# EAGLE design with-zener (EAGLE 7.6.0)
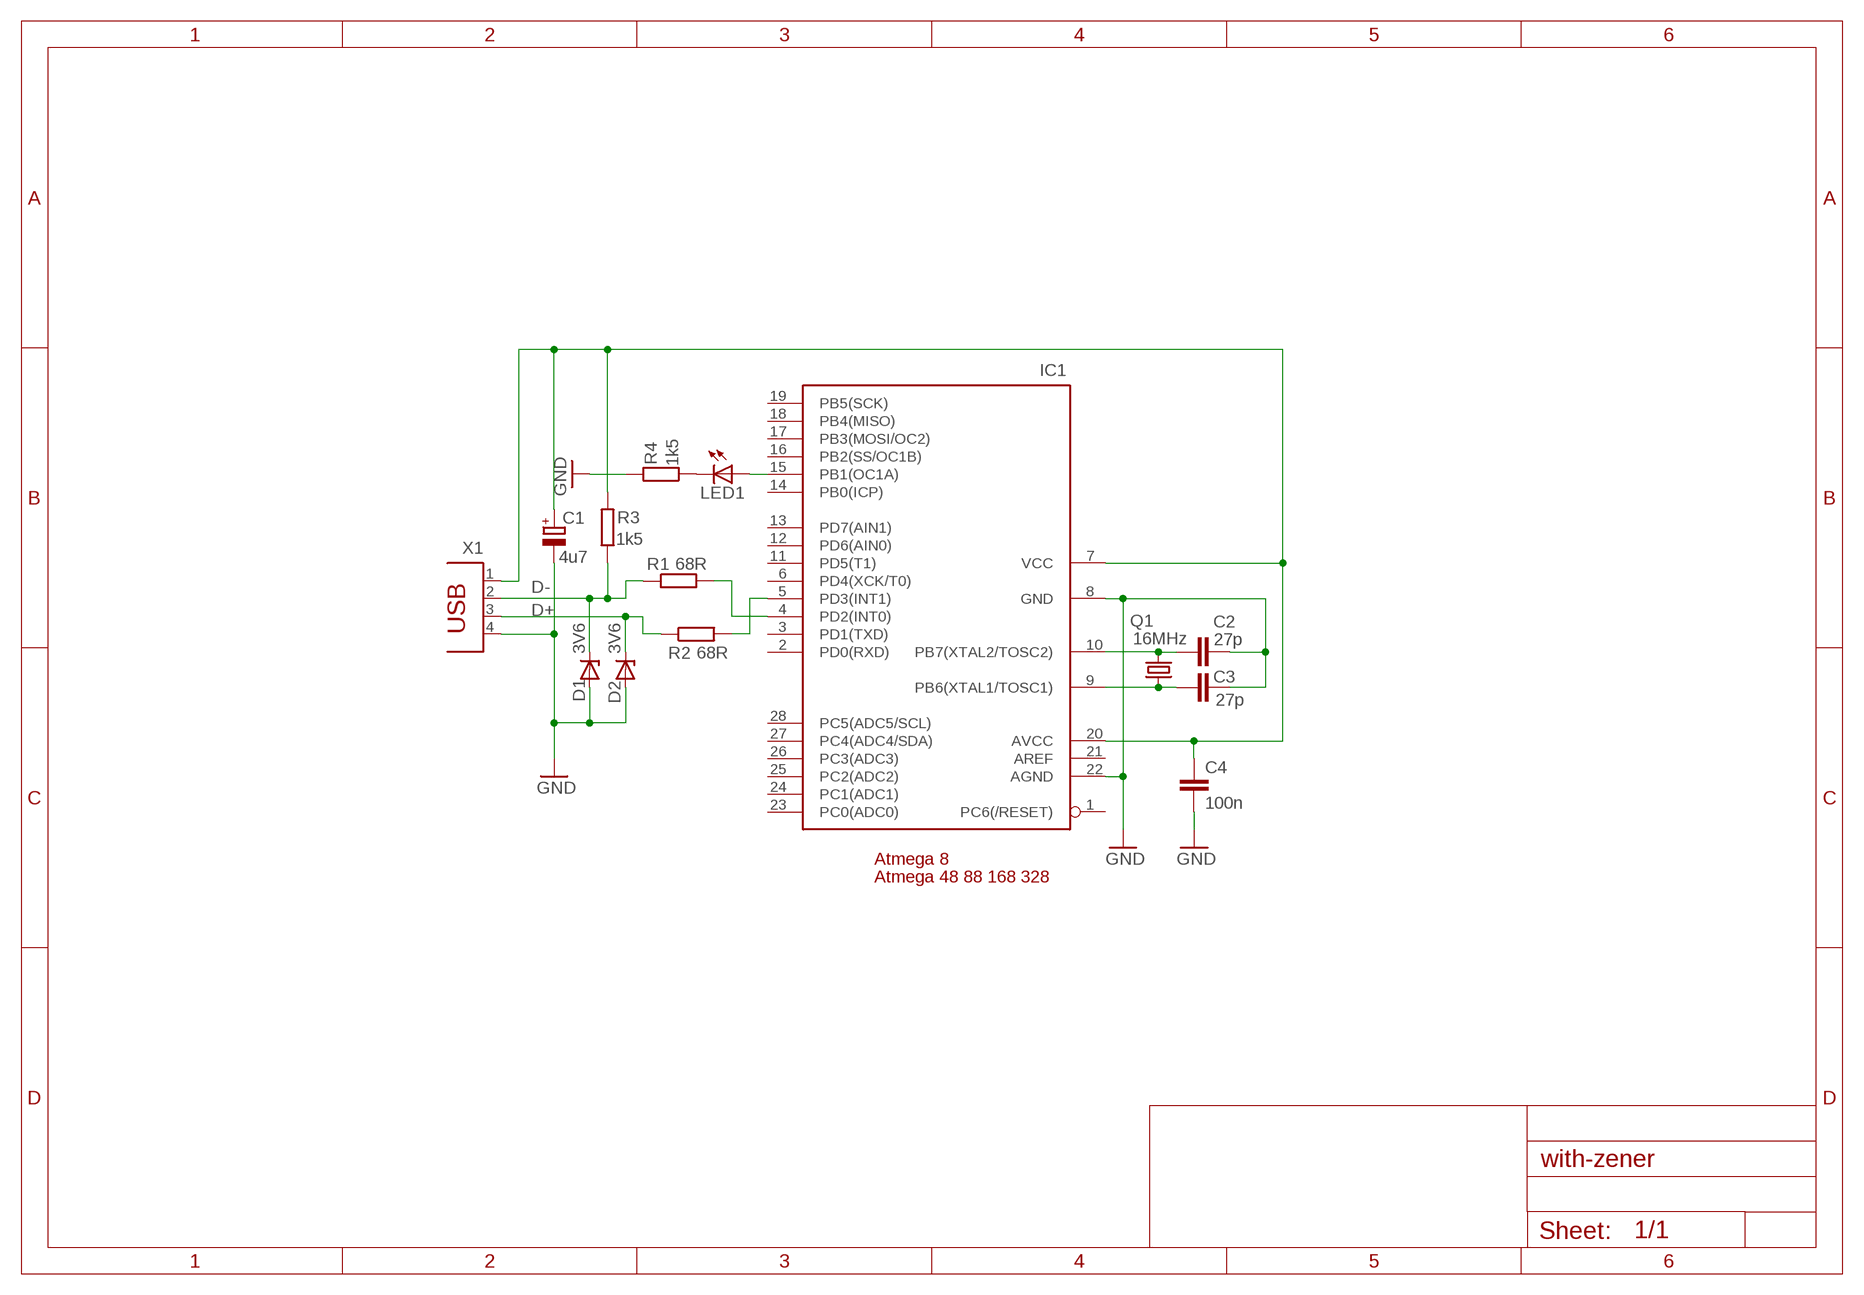
[diagram p0: schematic, sheet 1]

## Parts
C1  4u7  CPOL-EUE2-5  [E2-5]
C2  27p  C-EU025-024X044  [C025-024X044]
C3  27p  C-EU025-024X044  [C025-024X044]
C4  100n  C-EU025-024X044  [C025-024X044]
D1  3V6  ZENER-DIODEDO34-7  [DO34Z7]
D2  3V6  ZENER-DIODEDO34-7  [DO34Z7]
IC1  ATMEGA8-16P  [DIL28-3]
LED1  LED-3MM  [LED-3MM]
Q1  16MHz  CRYTALHC49U-V  [HC49U-V]
R1  68R  R-EU_0207/10  [0207/10]
R2  68R  R-EU_0207/10  [0207/10]
R3  1k5  R-EU_0207/10  [0207/10]
R4  1k5  R-EU_0207/10  [0207/10]
X1  PN61729  [PN61729]

## Nets
D+: D2.C R2.1 X1.3
D-: D1.C R1.1 R3.1 X1.2
GND: C1.- C2.2 C3.2 C4.2 D1.A D2.A IC1.8(GND) IC1.22(AGND) R4.2 X1.4
N$1: IC1.4(PD2(INT0)) R1.2
N$2: IC1.5(PD3(INT1)) R2.2
N$3: IC1.15(PB1(OC1A)) LED1.A
N$4: LED1.K(C) R4.1
N$9: C3.1 IC1.9(PB6(XTAL1/TOSC1)) Q1.1
N$10: C2.1 IC1.10(PB7(XTAL2/TOSC2)) Q1.2
VCC: C1.+ C4.1 IC1.7(VCC) IC1.20(AVCC) R3.2 X1.1
Unconnected: IC1.1(PC6(/RESET)) IC1.2(PD0(RXD)) IC1.3(PD1(TXD)) IC1.6(PD4(XCK/T0)) IC1.11(PD5(T1)) IC1.12(PD6(AIN0)) IC1.13(PD7(AIN1)) IC1.14(PB0(ICP)) IC1.16(PB2(SS/OC1B)) IC1.17(PB3(MOSI/OC2)) IC1.18(PB4(MISO)) IC1.19(PB5(SCK)) IC1.21(AREF) IC1.23(PC0(ADC0)) IC1.24(PC1(ADC1)) IC1.25(PC2(ADC2)) IC1.26(PC3(ADC3)) IC1.27(PC4(ADC4/SDA)) IC1.28(PC5(ADC5/SCL))

## Notes on the sheet
- Atmega 8
- Atmega 48 88 168 328

## Library data of the parts
C1 = rcl:CPOL-EU: POLARIZED CAPACITOR, European symbol
C2-C4 = rcl:C-EU: CAPACITOR, European symbol
D1 D2 = diode:ZENER-DIODE: Z-Diode
IC1 = avr:ATMEGA8*P: MICROCONTROLLER 8 Kbytes FLASH 1 kbytes SRAM 512 bytes EEPROM USART 4-channel 10 bit ADC 2-channel 8 bit ADC
LED1 = dp_devices:LED: Light Emitting Diode
Q1 = crystal:CRYTAL: CRYSTAL
R1-R4 = rcl:R-EU_: RESISTOR, European symbol
X1 = con-berg:PN61729: BERG USB connector

## Board
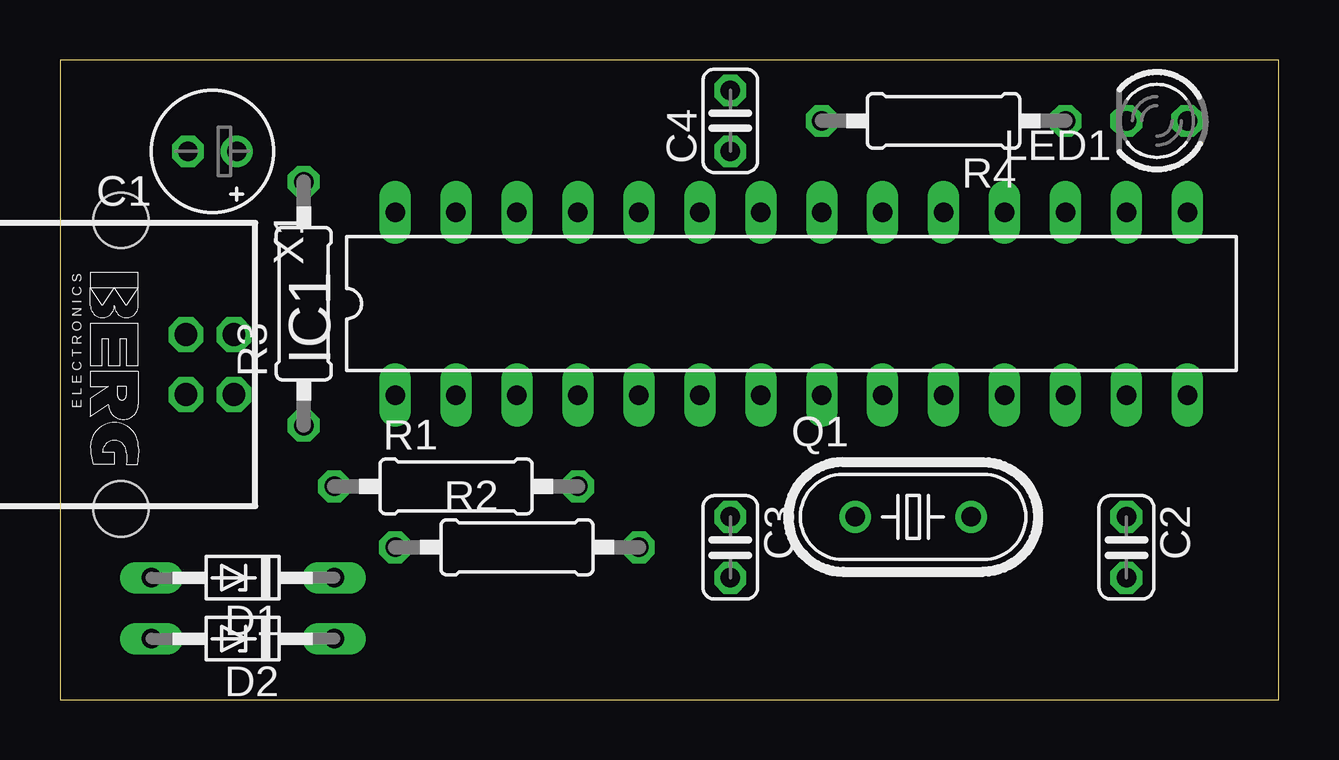
[diagram p1: board, top side]
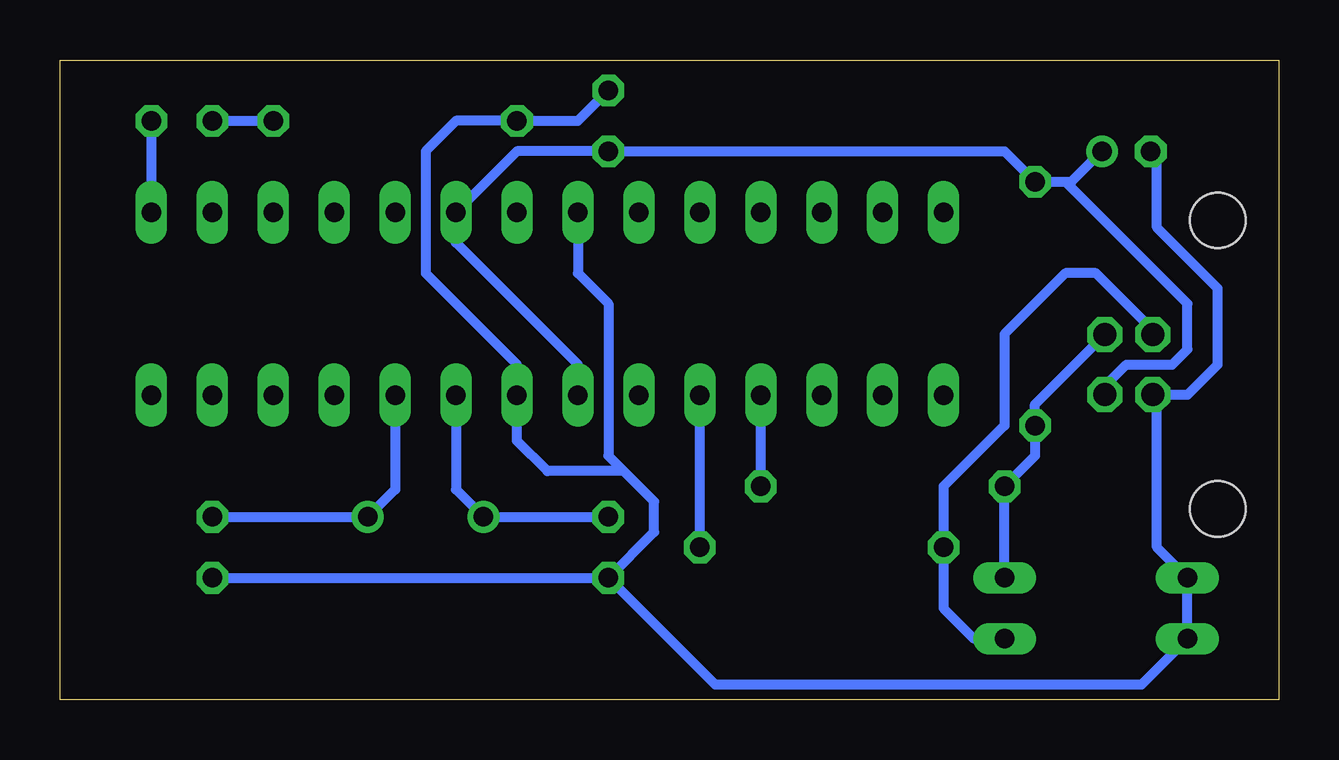
[diagram p2: board, bottom side, seen from below]

Size 50.8 x 26.67 mm. Coordinates in mm from the lower left corner, seen from the top.
Outline: 0,0 50.8,0 50.8,26.67 0,26.67 0,0
Copper layers (1*16): Top 0.035mm / dielectric 1.5mm / Bottom 0.035mm
Design rules "default": minimum track width 10mil, minimum drill 24mil, track to track 8mil, track to pad 8mil, pad to pad 8mil, via to via 8mil, smd to smd 8mil, copper to edge 40mil, drill to drill 8mil, minimum pad ring 10mil, minimum via ring 8mil, stop-mask expansion 4mil, vias tented up to drill 0mil, thermal gap 10mil

### Footprints (pad centres in the part's own frame; a part is rotated, then mirrored left to right if it is on the bottom)
E2-5 = drill 0.813 pad 1.27: + -1.016,0 | drill 0.813 pad 1.27 octagon: - 1.016,0
C025-024X044 = drill 0.813 octagon: 1 -1.27,0; 2 1.27,0
DO34Z7 = drill 0.813 long: A 3.81,0; C -3.81,0
DIL28-3 = drill 0.813 long: 1 -16.51,-3.81; 2 -13.97,-3.81; 3 -11.43,-3.81; 4 -8.89,-3.81; 5 -6.35,-3.81; 6 -3.81,-3.81; 7 -1.27,-3.81; 8 1.27,-3.81; 9 3.81,-3.81; 10 6.35,-3.81; 11 8.89,-3.81; 12 11.43,-3.81; 13 13.97,-3.81; 14 16.51,-3.81; 15 16.51,3.81; 16 13.97,3.81; 17 11.43,3.81; 18 8.89,3.81; 19 6.35,3.81; 20 3.81,3.81; 21 1.27,3.81; 22 -1.27,3.81; 23 -3.81,3.81; 24 -6.35,3.81; 25 -8.89,3.81; 26 -11.43,3.81; 27 -13.97,3.81; 28 -16.51,3.81
LED-3MM = drill 0.813 octagon: A -1.27,0; K 1.27,0
HC49U-V = drill 0.813: 1 -2.413,0; 2 2.413,0
0207/10 = drill 0.813 octagon: 1 -5.08,0; 2 5.08,0
PN61729 = drill 0.95 octagon: 1 1.25,4.71; 2 -1.25,4.71; 3 -1.25,2.71; 4 1.25,2.71 | hole 2.3: -6.02,0; 6.02,0

### Placement (x,y rotation side)
C1  6.35,22.86 180 top
C2  44.45,6.35 270 top
C3  27.94,6.35 270 top
C4  27.94,24.13 90 top
D1  7.62,5.08 180 top
D2  7.62,2.54 180 top
IC1  30.48,16.51 0 top
LED1  45.72,24.13 180 top
Q1  35.56,7.62 0 top
R1  16.51,8.89 0 top
R2  19.05,6.35 0 top
R3  10.16,16.51 90 top
R4  36.83,24.13 180 top
X1  2.54,13.97 270 top

### Tracks (layer width: path | path; a pad name or v marks a point on that pad's centre or on a via)
D+
  Bottom 0.406: D2.C 12.7,2.54 13.97,3.81 R2.1 13.97,8.89 11.43,11.43 11.43,15.24 8.89,17.78 7.62,17.78 5.25,15.41 X1.3
D-
  Bottom 0.406: D1.C R1.1 10.16,10.16 R3.1 10.16,12.31 X1.2
GND
  Bottom 0.406: C2.2 C3.2 | C3.2 26.04,6.99 26.04,8.26 27.3,9.53 | 27.3,9.53 30.48,9.53 31.75,10.79 IC1.8 31.75,13.97 35.56,17.78 35.56,22.86 34.29,24.13 R4.2 29.21,24.13 C4.2 | IC1.22 29.21,17.78 27.94,16.51 27.94,10.16 27.3,9.53 | C1.- 5.08,22.61 5.08,19.68 2.54,17.14 2.54,13.97 3.79,12.72 X1.4 5.08,12.55 5.08,6.35 D1.A D2.A 5.71,0.64 23.5,0.64 C3.2
N$1
  Bottom 0.406: R1.2 IC1.4
N$2
  Bottom 0.406: R2.2 IC1.5
N$3
  Bottom 0.406: LED1.A IC1.15
N$4
  Bottom 0.406: LED1.K R4.1
N$9
  Bottom 0.406: IC1.9 34.29,8.76 Q1.1 C3.1
N$10
  Bottom 0.406: IC1.10 36.83,8.76 Q1.2 C2.1
VCC
  Bottom 0.406: IC1.7 29.21,13.97 34.29,19.05 IC1.20 31.75,22.86 C4.1 11.43,22.86 R3.2 8.89,21.59 | 8.89,21.59 8.64,21.59 C1.+ | X1.1 7.25,13.07 6.35,13.97 4.45,13.97 3.81,14.61 3.81,16.51 8.89,21.59